# EAGLE design SV3 (EAGLE 9.6.2)
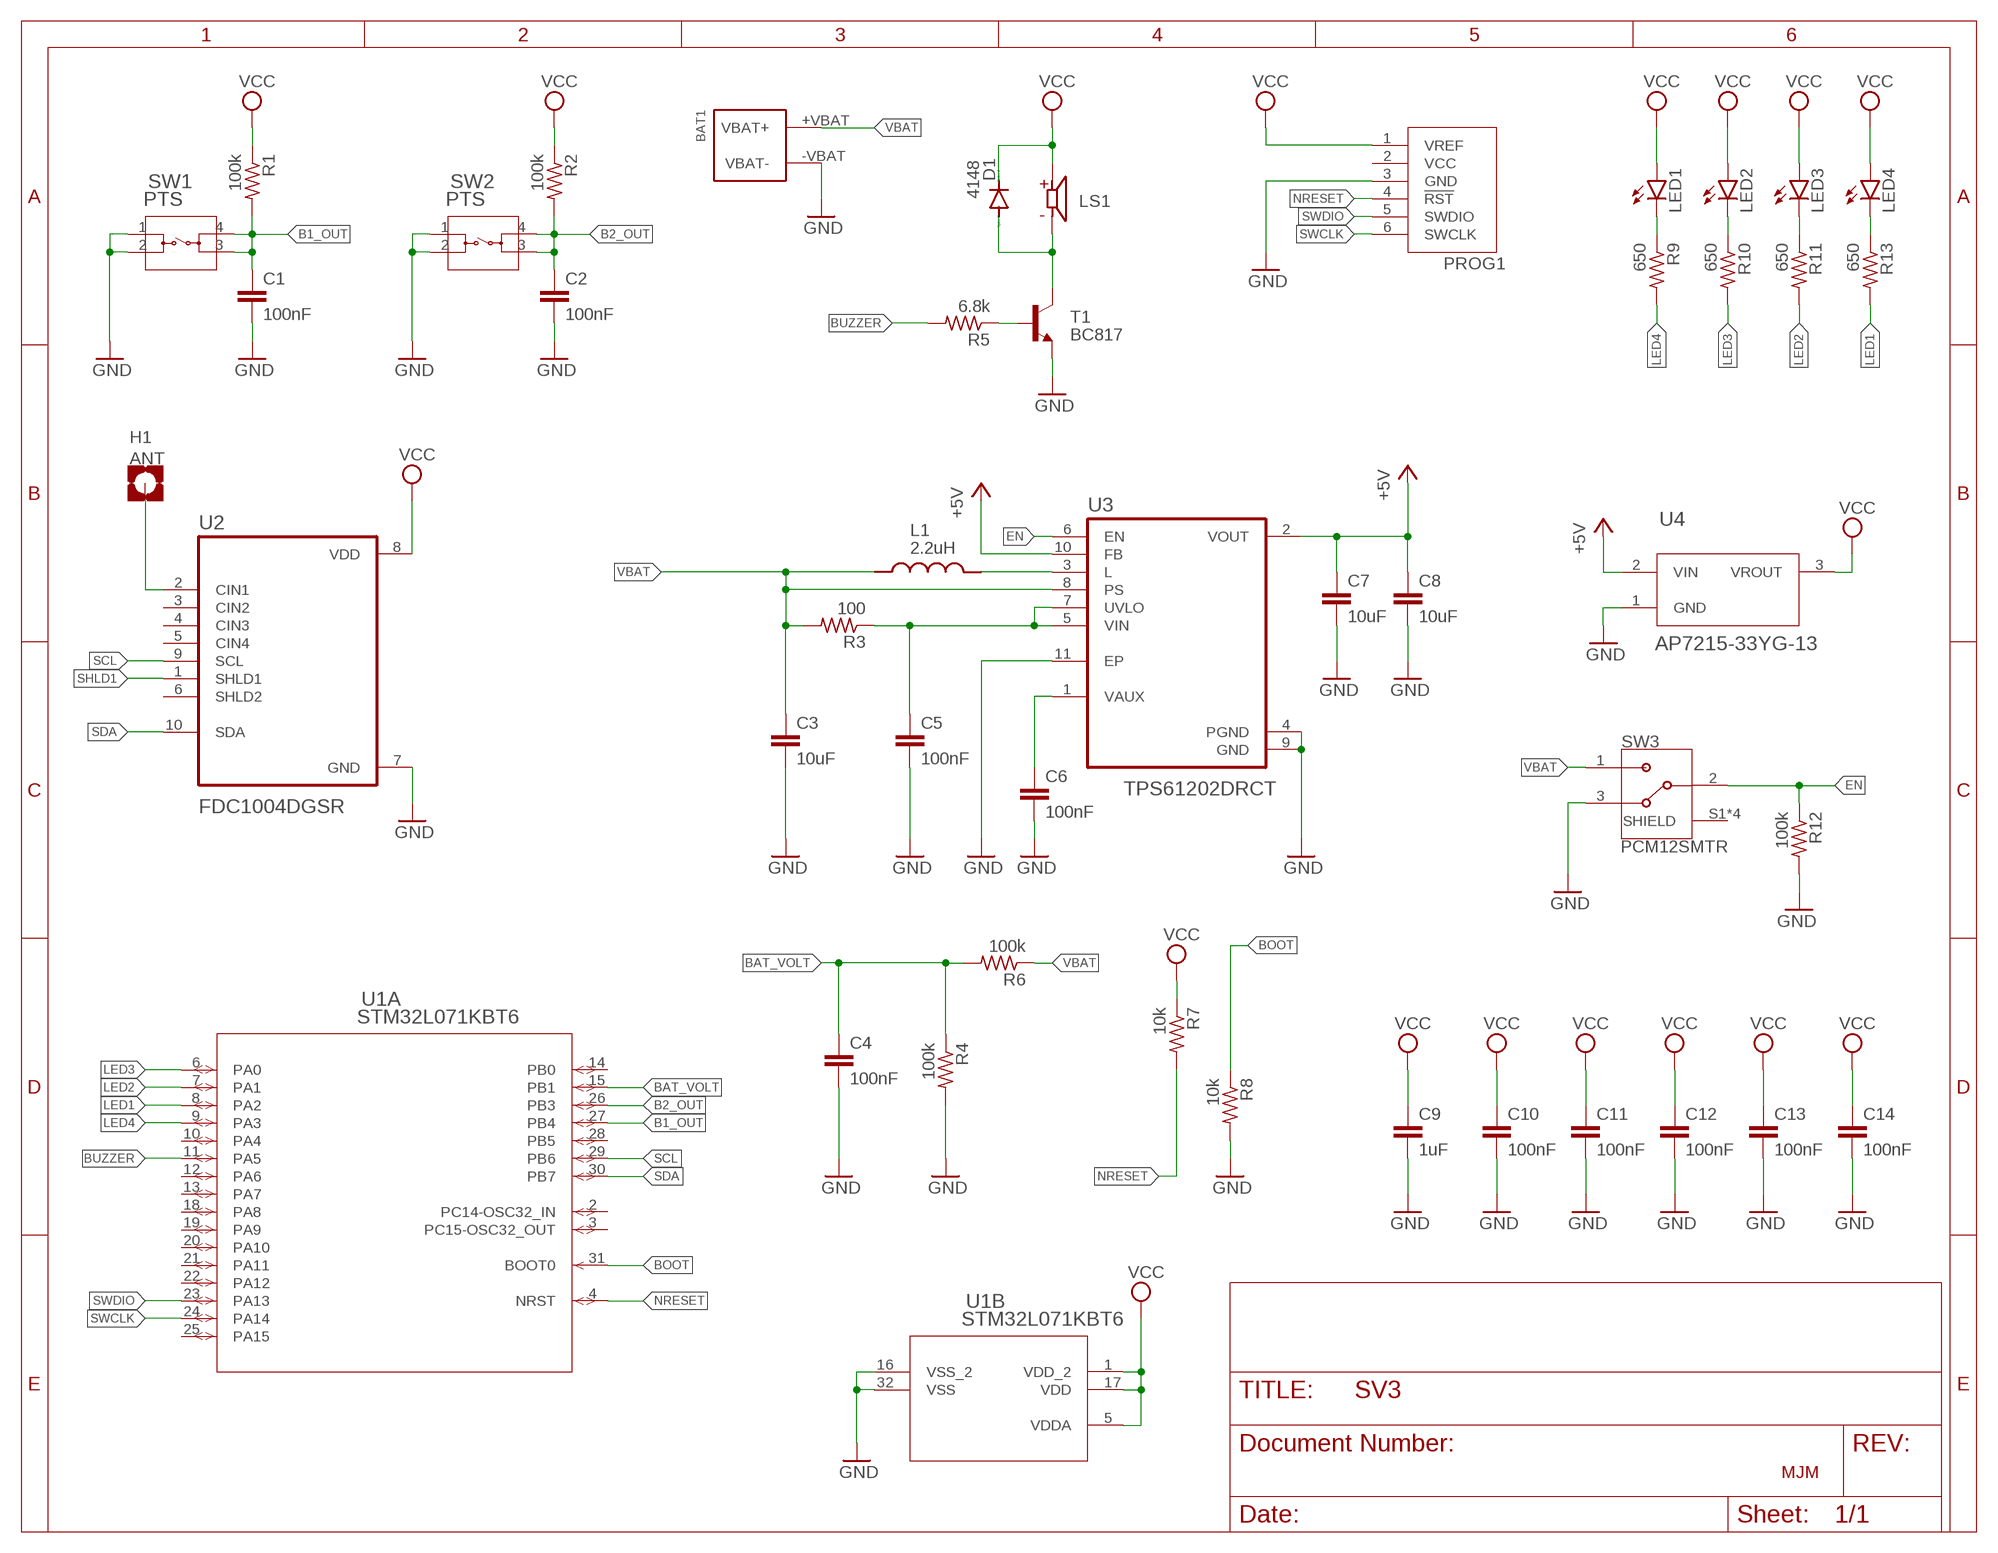
[diagram p0: schematic, sheet 1]

## Parts
BAT1  2462_NO_HOLES  [2462_NO-MOUNTING-HOLES]
C1  100nF  C-EUC0603  [C0603]
C2  100nF  C-EUC0603  [C0603]
C3  10uF  C-EUC0805  [C0805]
C4  100nF  C-EUC0603  [C0603]
C5  100nF  C-EUC0603  [C0603]
C6  100nF  C-EUC0603  [C0603]
C7  10uF  C-EUC0805  [C0805]
C8  10uF  C-EUC0805  [C0805]
C9  1uF  C-EUC0603  [C0603]
C10  100nF  C-EUC0603  [C0603]
C11  100nF  C-EUC0603  [C0603]
C12  100nF  C-EUC0603  [C0603]
C13  100nF  C-EUC0603  [C0603]
C14  100nF  C-EUC0603  [C0603]
D1  4148  DIODE-SOD80C  [SOD80C]
H1  ANT  ANT_37CM  [3,3-PAD-SQUARE]
L1  2.2uH  LQH2HPZ2R2MJRL  [IND_LQH2HPZ2R2MJRL]
LED1  LEDCHIPLED_0805  [CHIPLED_0805]
LED2  LEDCHIPLED_0805  [CHIPLED_0805]
LED3  LEDCHIPLED_0805  [CHIPLED_0805]
LED4  LEDCHIPLED_0805  [CHIPLED_0805]
LS1  CSS-0575A-SMT  [CUI_CSS-0575A-SMT]
PROG1  0532610671  [0532610671]
R1  100k  R-US_R0603  [R0603]
R2  100k  R-US_R0603  [R0603]
R3  100  R-US_R0603  [R0603]
R4  100k  R-US_R0603  [R0603]
R5  6.8k  R-US_R0603  [R0603]
R6  100k  R-US_R0603  [R0603]
R7  10k  R-US_R0603  [R0603]
R8  10k  R-US_R0603  [R0603]
R9  650  R-US_R0603  [R0603]
R10  650  R-US_R0603  [R0603]
R11  650  R-US_R0603  [R0603]
R12  100k  R-US_R0603  [R0603]
R13  650  R-US_R0603  [R0603]
SW1  PTS  PTS_647_SN50_SMTR2_LFSPTS_647_SN50_SMTR2_LFS-M  [PTS_647_SN50_SMTR2_LFS-M]
SW2  PTS  PTS_647_SN50_SMTR2_LFSPTS_647_SN50_SMTR2_LFS-M  [PTS_647_SN50_SMTR2_LFS-M]
SW3  PCM12SMTR  [SW_PCM12SMTR]
T1  BC817  MMBT2222ALT1-NPN-SOT23-BEC  [SOT23-BEC]
U1  STM32L071KBT6  [LQFP32_7X7X1P4]
U2  FDC1004DGSR  [SOP50P490X110-10N]
U3  TPS61202DRCT  TPS61201DRCR  [VREG_V62/16624-01YE]
U4  AP7215-33YG-13  AP7215-33YG-13SOT89-3L_DIO-L  [SOT89-3L_DIO-L]

## Nets
+5V: C7.1 C8.1 U3.2(VOUT) U3.10(FB) U4.2(VIN)
B: R5.1 T1.B
B1_OUT: C1.1 R1.2 SW1.3 SW1.4 U1.27(A:PB4)
B2_OUT: C2.1 R2.2 SW2.3 SW2.4 U1.26(A:PB3)
BAT_VOLT: C4.1 R4.1 R6.2 U1.15(A:PB1)
BOOT: R8.1 U1.31(A:BOOT0)
BUZZER: R5.2 U1.11(A:PA5)
C: D1.A LS1.2(N) T1.C
EN: R12.1 SW3.2 U3.6(EN)
GND: BAT1.-VBAT(VBAT-) C1.2 C2.2 C3.2 C4.2 C5.2 C6.2 C7.2 C8.2 C9.2 C10.2 C11.2 C12.2 C13.2 C14.2 PROG1.3(GND) R4.2 R8.2 R12.2 SW1.1 SW1.2 SW2.1 SW2.2 SW3.3 T1.E U1.16(B:VSS_2) U1.32(B:VSS) U2.7(GND) U3.4(PGND) U3.9(GND) U3.11(EP) U4.1(GND)
LED1: R13.2 U1.8(A:PA2)
LED2: R11.2 U1.7(A:PA1)
LED3: R10.2 U1.6(A:PA0)
LED4: R9.2 U1.9(A:PA3)
N$2: H1.B3,3(MOUNT) U2.2(CIN1)
N$4: C5.1 R3.1 U3.5(VIN) U3.7(UVLO)
N$6: L1.2 U3.3(L)
N$7: C6.1 U3.1(VAUX)
N$11: LED1.C R9.1
N$12: LED2.C R10.1
N$14: LED3.C R11.1
N$15: LED4.C R13.1
NRESET: PROG1.4(!RST) R7.2 U1.4(A:NRST)
SCL: U1.29(A:PB6) U2.9(SCL)
SDA: U1.30(A:PB7) U2.10(SDA)
SHLD1: U2.1(SHLD1)
SWCLK: PROG1.6(SWCLK) U1.24(A:PA14)
SWDIO: PROG1.5(SWDIO) U1.23(A:PA13)
VBAT: BAT1.+VBAT(VBAT+) C3.1 L1.1 R3.2 R6.1 SW3.1 U3.8(PS)
VCC: C9.1 C10.1 C11.1 C12.1 C13.1 C14.1 D1.C LED1.A LED2.A LED3.A LED4.A LS1.1(P) PROG1.1(VREF) R1.1 R2.1 R7.1 U1.1(B:VDD_2) U1.5(B:VDDA) U1.17(B:VDD) U2.8(VDD) U4.3(VROUT)
Unconnected: PROG1.2(VCC) SW3.S1(SHIELD) SW3.S2(SHIELD) SW3.S3(SHIELD) SW3.S4(SHIELD) U1.2(A:PC14-OSC32_IN) U1.3(A:PC15-OSC32_OUT) U1.10(A:PA4) U1.12(A:PA6) U1.13(A:PA7) U1.14(A:PB0) U1.18(A:PA8) U1.19(A:PA9) U1.20(A:PA10) U1.21(A:PA11) U1.22(A:PA12) U1.25(A:PA15) U1.28(A:PB5) U2.3(CIN2) U2.4(CIN3) U2.5(CIN4) U2.6(SHLD2)

## Notes on the sheet
- MJM

## Library data of the parts
BAT1 = 2462_batt_holder:2462
C1-C14 = rcl:C-EU: CAPACITOR, European symbol; SPICEPREFIX: C
D1 = diode:DIODE-: DIODE
H1 = ANT_37CM:ANT_37CM
L1 = LQH2HPZ2R2MJRL:LQH2HPZ2R2MJRL: 10µH Shielded Wirewound Inductor 490mA 456mOhm Max 1008 (2520 Metric); DESCRIPTION: Inductor with Inductance: 2.2uH Tol. +/-20%, Package: 1008 (2520); DIGI-KEY_PART_NUMBER: 490-15899-1-ND; MF: Murata; MP: LQH2HPZ2R2MJRL; PACKAGE: NONSTANDARD
LED1-LED4 = led:LED: LED OSRAM: - CHIPLED LG R971, LG N971, LY N971, LG Q971, LY Q971, LO R971, LY R971 LH N974, LH R974 LS Q976, LO Q976, LY Q976 LO Q996 - Hyper CHIPLED LW Q18S LB Q993, LB Q99A, LB R99A - SideLED LS A670, LO A670, LY A670, LG A670, LP A670 LB A673, LV A673, LT A673, LW A673 LH A674 LY A675 LS A676, LA A676, LO A676, LY A676, LW A676 LS A679, LY A679, LG A679 - Hyper Micro SIDELED® LS Y876, LA Y876, LO Y876, LY Y876 LT Y87S - SmartLED LW L88C, LW L88S LB L89C, LB L89S, LG L890 LS L89K, LO L89K, LY L89K LS L896, LA L896, LO L896, LY L896 - TOPLED LS T670, LO T670, LY T670, LG T670, LP T670 LSG T670, LSP T670, LSY T670, LOP T670, LYG T670 LG T671, LOG T671, LSG T671 LB T673, LV T673, LT T673, LW T673 LH T674 LS T676, LA T676, LO T676, LY T676, LB T676, LH T676, LSB T676, LW T676 LB T67C, LV T67C, LT T67C, LS T67K, LO T67K, LY T67K, LW E67C LS E67B, LA E67B, LO E67B, LY E67B, LB E67C, LV E67C, LT E67C LW T67C LS T679, LY T679, LG T679 LS T770, LO T770, LY T770, LG T770, LP T770 LB T773, LV T773, LT T773, LW T773 LH T774 LS E675, LA E675, LY E675, LS T675 LS T776, LA T776, LO T776, LY T776, LB T776 LHGB T686 LT T68C, LB T68C - Hyper Mini TOPLED® LB M676 - Mini TOPLED Santana® LG M470 LS M47K, LO M47K, LY M47K Source: http://www.osram.convergy.de LUXEON: - LUMILED® LXK2-PW12-R00, LXK2-PW12-S00, LXK2-PW14-U00, LXK2-PW14-V00 LXK2-PM12-R00, LXK2-PM12-S00, LXK2-PM14-U00 LXK2-PE12-Q00, LXK2-PE12-R00, LXK2-PE12-S00, LXK2-PE14-T00, LXK2-PE14-U00 LXK2-PB12-K00, LXK2-PB12-L00, LXK2-PB12-M00, LXK2-PB14-N00, LXK2-PB14-P00, LXK2-PB14-Q00 LXK2-PR12-L00, LXK2-PR12-M00, LXK2-PR14-Q00, LXK2-PR14-R00 LXK2-PD12-Q00, LXK2-PD12-R00, LXK2-PD12-S00 LXK2-PH12-R00, LXK2-PH12-S00 LXK2-PL12-P00, LXK2-PL12-Q00, LXK2-PL12-R00 Source: www.luxeon.com KINGBRIGHT: KA-3528ASYC Source: www.kingbright.com
LS1 = CSS-0575A-SMT:CSS-0575A-SMT: 5 mm, 3 V, 75 dB, Surface Mount (SMT), Magnetic Audio Transducer Buzzer; CUI_PURCHASE_URL: https://www.cuidevices.com/product/audio/buzzers/audio-transducers/css-0575a-smt-tr?utm_source=snapeda.com&utm_medium=referral&utm_campaign=snapedaBOM; DESCRIPTION: 5 mm, 3 V, 76 dB, Surface Mount (SMT), Magnetic Audio Transducer Buzzer; DIGI-KEY_PART_NUMBER: 102-2201-1-ND; MF: CUI Devices; MP: CSS-0575A-SMT-TR; PACKAGE: 6-DIP-6 CUI
PROG1 = 0532610671:0532610671
R1-R13 = rcl:R-US_: RESISTOR, American symbol; SPICEPREFIX: R
SW1 SW2 = PTS-647-SN50-SMTR2-LFS:PTS_647_SN50_SMTR2_LFS; BUILT_BY: EMA_Cory; COPYRIGHT: Copyright (C) 2018 Accelerated Designs. All rights reserved; DATASHEET: https://dznh3ojzb2azq.cloudfront.net/products/Tactile/PTS647/documents/datasheet.pdf; MANUFACTURER_PART_NUMBER: PTS 647 SN50 SMTR2 LFS; SOURCELIBRARY: C&K_2020-03-06; VENDOR: C&K
SW3 = PCM12SMTR:PCM12SMTR: Switch Slide ON ON SPDT Side Slide 0.3A 6VDC 10000Cycles Gull Wing SMD T/R; DESCRIPTION: Slide Switch SPDT Surface Mount, Right Angle; DIGI-KEY_PART_NUMBER: 401-2016-1-ND; MF: C&K; MP: PCM12SMTR; PACKAGE: DO-201 C&amp;K Components
T1 = transistor:*-NPN-: NPN Transistror BF959 corrected 2008.03.06
U1 = STM32L071KBT6:STM32L071KBT6; BUILT_BY: EMA_UL_Team; COPYRIGHT: Copyright (C) 2018 Accelerated Designs. All rights reserved; MANUFACTURER_PART_NUMBER: STM32L071KBT6; SOURCELIBRARY: Updates_to_database_2020-10-19; VENDOR: STMicroelectronics
U2 = FDC1004DGSR:FDC1004DGSR: Check prices <https://pricing.snapeda.com/parts/FDC1004DGSR/Texas%20Instruments/view-part?ref=eda>; AVAILABILITY: In Stock; DESCRIPTION: 4-Ch, 16-bit, capacitance to digital converter with active shield driver 10-VSSOP -40 to 125; MF: Texas Instruments; MP: FDC1004DGSR; PACKAGE: VSSOP-10 Texas Instruments; PRICE: None; PURCHASE-URL: https://pricing.snapeda.com/search/part/FDC1004DGSR/?ref=eda
U3 = TPS61201DRCR:TPS61201DRCR; DESCRIPTION: 0.3V Input, 3.3V Output Voltage Boost Converter with 1.3A Switches and 'Down Mode' in a 3x3 QFN 10-VSON -40 to 85; DIGI-KEY_PART_NUMBER: 296-44338-1-ND; MF: Texas Instruments; MP: TPS61201DRCR; PACKAGE: VSON-10 Texas Instruments; PURCHASE-URL: https://pricing.snapeda.com/search/part/TPS61201DRCR/?ref=eda
U4 = AP7215-33YG-13:AP7215-33YG-13; BUILT_BY: EMA_UL_Team; MANUFACTURER_PART_NUMBER: AP7215-33YG-13; SOURCELIBRARY: DIODESINC_2_2015-08-18; VENDOR: Diodes Inc

## Board
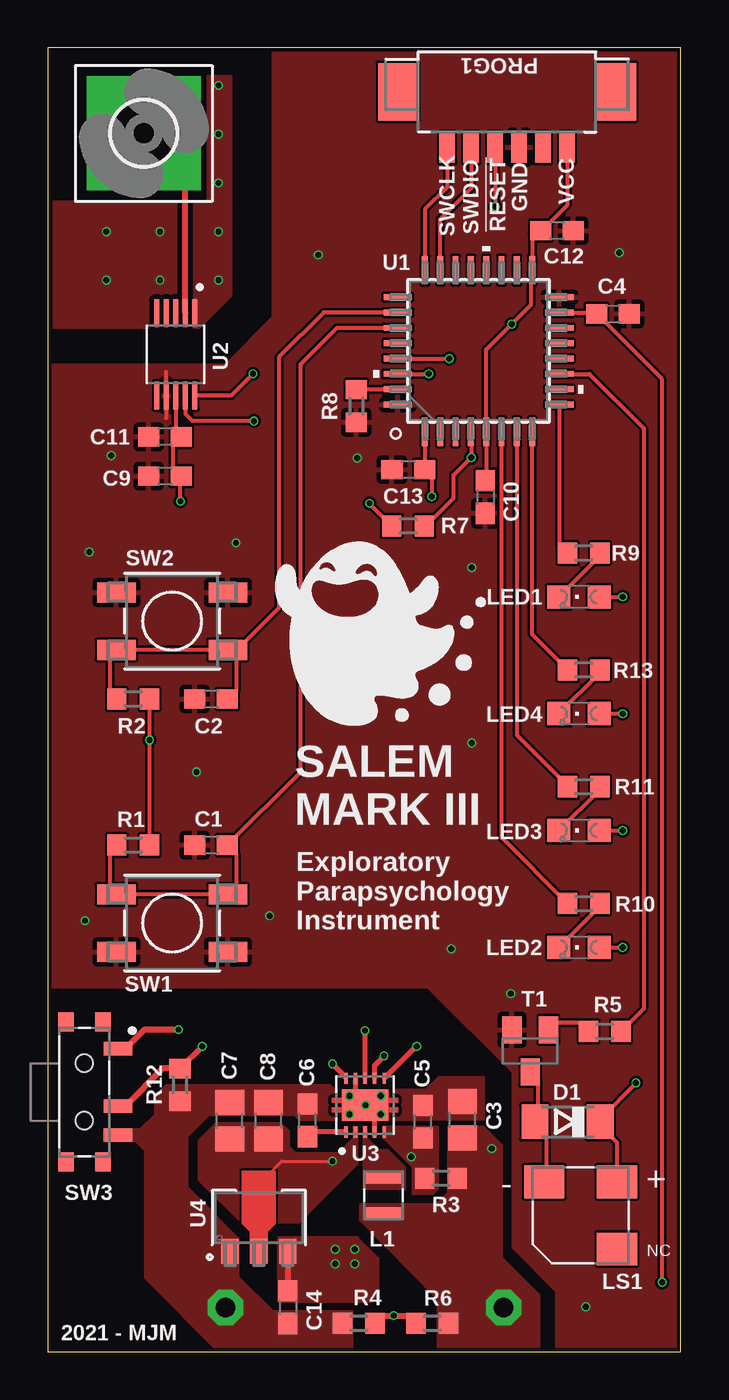
[diagram p1: board, top side]
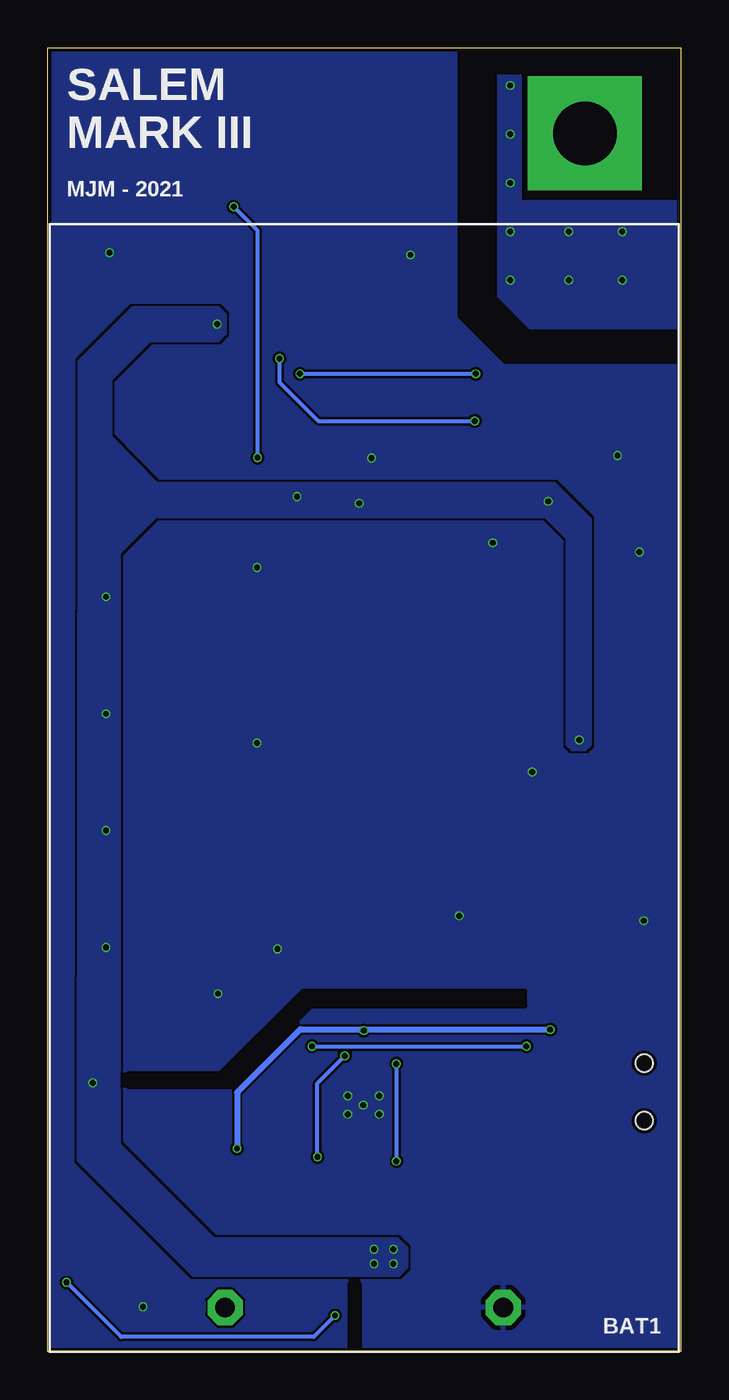
[diagram p2: board, bottom side, seen from below]

Size 33 x 68 mm. Coordinates in mm from the lower left corner, seen from the top.
Outline: 0,0 33,0 33,68 0,68 0,0
Copper layers (1*16): Top 0.035mm / dielectric 1.6mm / Bottom 0.035mm
Design rules "jlcpcb-2layers_tinted_vias": minimum track width 5mil, minimum drill 0.3mm, track to track 5mil, track to pad 5mil, pad to pad 5mil, via to via 5mil, smd to smd 5mil, copper to edge 0.2mm, drill to drill 6mil, minimum pad ring 10mil, minimum via ring 3mil, stop-mask expansion 4mil, vias tented up to drill 20mil, thermal gap 10mil
bRestrict: 12 lines

### Footprints (pad centres in the part's own frame; a part is rotated, then mirrored left to right if it is on the bottom)
2462_NO-MOUNTING-HOLES = drill 1.02 octagon: +VBAT 7.25,-2.3; -VBAT -7.25,-2.3
C0603 = smd 1.1 x 1: 1 -0.85,0; 2 0.85,0
C0805 = smd 1.3 x 1.5: 1 -0.95,0; 2 0.95,0
SOD80C = smd 1.4 x 1.8: A 1.7,0; C -1.7,0
3,3-PAD-SQUARE = drill 3.3 pad 5.842 square: B3,3 0,0
IND_LQH2HPZ2R2MJRL = smd 0.625 x 2: 1 -0.938,0; 2 0.938,0
CHIPLED_0805 = smd 1.2 x 1.2: A 0,-1.05; C 0,1.05
CUI_CSS-0575A-SMT = smd 2.1 x 1.7: 1 -1.9,-1.75; 2 1.9,-1.75; 3 -1.9,1.75
0532610671 = smd 0.8 x 1.6: 1 -3.125,0.8; 2 -1.875,0.8; 3 -0.625,0.8; 4 0.625,0.8; 5 1.875,0.8; 6 3.125,0.8 | smd 2.1 x 3: 7 -5.675,-2.1; 8 5.67,-2.1
R0603 = smd 1 x 1.1: 1 -0.85,0; 2 0.85,0
PTS_647_SN50_SMTR2_LFS-M = smd 2.007 x 1.041: 1 -2.908,1.5; 2 2.908,1.5; 3 -2.908,-1.5; 4 2.908,-1.5
SW_PCM12SMTR = smd 0.7 x 1.5: 1 -2.25,1.75; 2 0.75,1.75; 3 2.25,1.75 | smd 1 x 0.8: S1 -3.65,0.965; S2 -3.65,-0.965; S3 3.65,-0.965; S4 3.65,0.965 | hole 0.9: -1.5,0; 1.5,0
SOT23-BEC = smd 1 x 1.4: B -0.95,-1.1; C 0,1.1; E 0.95,-1.1
LQFP32_7X7X1P4 = smd 1.473 x 0.305: 1 -4.216,2.8; 2 -4.216,2; 3 -4.216,1.2; 4 -4.216,0.4; 5 -4.216,-0.4; 6 -4.216,-1.2; 7 -4.216,-2; 8 -4.216,-2.8; 17 4.216,-2.8; 18 4.216,-2; 19 4.216,-1.2; 20 4.216,-0.4; 21 4.216,0.4; 22 4.216,1.2; 23 4.216,2; 24 4.216,2.8 | smd 0.305 x 1.473: 9 -2.8,-4.216; 10 -2,-4.216; 11 -1.2,-4.216; 12 -0.4,-4.216; 13 0.4,-4.216; 14 1.2,-4.216; 15 2,-4.216; 16 2.8,-4.216; 25 2.8,4.216; 26 2,4.216; 27 1.2,4.216; 28 0.4,4.216; 29 -0.4,4.216; 30 -1.2,4.216; 31 -2,4.216; 32 -2.8,4.216
SOP50P490X110-10N = smd 1.47 x 0.28: 1 -2.15,1; 2 -2.15,0.5; 3 -2.15,0; 4 -2.15,-0.5; 5 -2.15,-1; 6 2.15,-1; 7 2.15,-0.5; 8 2.15,0; 9 2.15,0.5; 10 2.15,1
VREG_V62/16624-01YE = smd 0.6 x 0.24: 1 -1.4,1; 2 -1.4,0.5; 3 -1.4,0; 4 -1.4,-0.5; 5 -1.4,-1; 6 1.4,-1; 7 1.4,-0.5; 8 1.4,0; 9 1.4,0.5; 10 1.4,1 | smd 1.65 x 2.4: 11 0,0
SOT89-3L_DIO-L = smd 0.9 x 1.3: 1 -1.5,-1.751; 2 0,-1.751; 3 1.5,-1.751

### Placement (x,y rotation side)
BAT1  16.51,0 180 bottom
C1  8.51,26.42 180 top
C2  8.51,34.04 180 top
C3  21.62,12.09 90 top
C4  29.46,54.13 0 top
C5  19.56,11.99 90 top
C6  13.54,12.06 90 top
C7  9.47,12.04 90 top
C8  11.51,12.04 90 top
C9  6.1,45.66 180 top
C10  22.81,44.58 270 top
C11  6.1,47.71 180 top
C12  26.55,58.47 0 top
C13  18.79,46 180 top
C14  12.5,2.31 270 top
D1  27.1,11.99 180 top
H1  5,63.54 0 top
L1  17.5,8.15 90 top
LED1  27.69,39.37 90 top
LED2  27.69,21.08 90 top
LED3  27.69,27.18 90 top
LED4  27.69,33.27 90 top
LS1  27.77,7.11 180 top
PROG1  23.94,63.61 180 top
R1  4.45,26.42 180 top
R2  4.45,34.04 180 top
R3  20.5,9.04 0 top
R4  16.21,1.47 180 top
R5  29.03,16.7 0 top
R6  20.04,1.47 180 top
R7  18.78,43.07 0 top
R8  16.08,49.32 270 top
R9  27.94,41.66 180 top
R10  27.94,23.37 180 top
R11  27.94,29.46 180 top
R12  6.88,13.91 270 top
R13  27.94,35.56 180 top
SW1  6.48,22.35 180 top
SW2  6.48,38.1 0 top
SW3  1.9,13.54 270 top
T1  25.15,15.68 180 top
U1  22.45,52.2 90 top
U2  6.66,52.02 270 top
U3  16.54,12.85 90 top
U4  11,6.99 0 top
U$1  [GHOST]  11.68,32.56 0 top

### Tracks (layer width: path | path; a pad name or v marks a point on that pad's centre or on a via)
+5V  (via drill 0.3)
  Top 0.152: U3.10 15.54,14.31 | U4.2 11,8.74 12.19,9.93 v14.83,9.93
  Top 0.254: 15.54,14.31 v14.83,15.01
  Bottom 0.203: v14.83,15.01 v14.83,9.93
  pour Top (no thermals): 15.95,11.73 16.13,11.73 16.13,9.75 13.08,6.71 10.11,6.71 7.87,8.94 7.87,11.02 8.79,11.94 12.12,11.94 12.55,11.51 12.55,10.72 12.9,10.36 15.16,10.36 15.95,11.15
B
  Top 0.203: R5.1 27.74,17.14 26.45,17.14 T1.B
B1_OUT
  Top 0.203: R1.2 3.21,26.03 3.21,24.21 SW1.4 SW1.3 9.82,24.28 9.82,25.96 C1.1 13.16,30.21 13.16,51.49 15.07,53.4 U1.27
B2_OUT
  Top 0.152: SW2.4 9.85,36.6
  Top 0.203: R2.2 3.21,34.42 3.21,36.24 SW2.3 SW2.4 9.82,36.17 9.82,34.49 C2.1 | 9.85,36.6 12.04,38.79 12.04,51.87 14.37,54.2 U1.26
BAT_VOLT  (via drill 0.3)
  Top 0.203: U1.15 28.54,54.2 C4.1 32.03,50.71 v32.03,3.61 | R4.1 17.46,1.88
  Top 0.305: 17.46,1.88 v18.03,1.88 18.78,1.88 R6.2
  Bottom 0.203: v18.03,1.88 19.15,0.76 29.18,0.76 v32.03,3.61
BOOT
  Top 0.152: R8.1 16.11,50.2
  Top 0.203: 16.11,50.2 U1.31
BUZZER
  Top 0.152: R5.2
  Top 0.203: U1.11 28.23,51 31.06,48.16 31.06,17.88 R5.2
C
  Top 0.203: T1.C 25.55,14.18 25.55,12.14 D1.A 25.98,11.4 25.98,8.96 LS1.2
EN  (via drill 0.3)
  Top 0.152: 17.55,14.27 U3.6
  Top 0.203: v8.05,15.93 | v19.23,15.93 19.21,15.93 | SW3.2 4.03,12.79
  Top 0.254: 19.21,15.93 17.55,14.27
  Top 0.305: v8.05,15.93 R12.1 6,14.76 4.03,12.79
  Bottom 0.203: v19.23,15.93 v8.05,15.93
GND  (via drill 0.3)
  Top 0.203: 6.16,48.71 U2.7 6.16,51.09
  Top 0.254: U3.9 16.04,13.24 | U3.4 17.04,12.38
  other vias: 16.56,12.85 15.72,13.34 15.72,12.38 17.36,13.34 17.36,12.38 24.13,18.67 1.93,22.48 2.16,41.71 3.3,46.74 29.79,57.33 16.13,46.61 22.1,40.89 7.75,30.23 11.56,22.73 22.1,31.75 14.1,57.2 9.8,42.19 28.04,2.34 21.03,21.01
  pour Top (isolate 0.203, no thermals): 2.95,11.61 4.8,11.61 5.59,12.37 5.59,13.35 6.17,13.92 14.71,13.92 14.96,13.67 19.71,13.67 20.37,14.33 22.73,14.33 22.73,12.09 20.02,12.09 19.99,12.06 13.13,12.06 12.88,12.32 8.38,12.32 7.26,11.2 7.26,8.59 9.93,5.92 9.93,3.91 11.71,2.13 15.88,2.13 15.88,0 8.89,0 5.08,3.81 5.08,10.46 4.57,10.97 2.95,10.97
  pour Top: 33.02,67.94 11.76,67.94 11.76,53.92 9.27,51.44 0,51.44 0,19.05 19.81,19.05 24.26,14.61 24.26,5.46 26.54,3.17 26.54,0 33.02,0
  pour Bottom (rank 5): 0,51.44 0,0 33.02,0 33.02,67.94 11.76,67.94 11.76,53.92 9.27,51.44
LED1
  Top 0.152: R13.2 27.09,35.57
  Top 0.203: 27.09,35.57 25.25,37.41 U1.8
LED2
  Top 0.152: 27.09,29.53 R11.2
  Top 0.203: U1.7 24.45,32.16 27.09,29.53
LED3
  Top 0.152: R10.2
  Top 0.203: R10.2 23.65,26.82 U1.6
LED4
  Top 0.203: U1.9 26.67,42.08 R9.2
N$2
  Top 0.305: U2.2 7.16,60.87 5,63.03 H1.B3,3
N$4  (via drill 0.3)
  Top 0.254: U3.7 17.04,14.93 v17.53,15.42
  Bottom 0.203: v18.95,10.16 18.95,13.99 v17.53,15.42
  pour Top (no thermals): 17.45,11.71 17.45,11.18 19,9.63 19,8.23 20.09,8.23 20.35,8.48 20.35,11.71
N$6
  pour Top (no thermals): 16.43,11.73 16.43,8.48 18.64,8.48 18.64,9.6 17.75,10.49 17.27,10.49 16.64,11.13 16.64,11.73
N$7
  Top 0.152: 13.57,11.25 C6.1
  Top 0.203: 13.78,11.45 13.57,11.25
  Top 0.254: U3.1 13.78,11.45
N$11
  Top 0.203: LED1.C 28.79,41.52 R9.1
N$12
  Top 0.203: LED2.C 28.79,23.24 R10.1
N$14
  Top 0.203: LED3.C 28.79,29.33 R11.1
N$15
  Top 0.203: LED4.C 28.79,35.43 R13.1
NRESET  (via drill 0.3)
  Top 0.203: PROG1.4 v23.32,59.72 | U1.4 22.07,47.96 v22.07,46.63 21.16,45.72 21.16,44.53 19.7,43.07 R7.2
  Bottom 0.203: v23.32,59.72 22.07,58.47 v22.07,46.63
SCL  (via drill 0.3)
  Top 0.203: U2.9 7.16,48.92 7.54,48.54 v10.74,48.54 | U1.29 v20.92,51.8 v20.93,51.79
  Bottom 0.203: v20.93,51.79 20.93,50.57 18.9,48.54 v10.74,48.54
SDA  (via drill 0.3)
  Top 0.203: U2.10 9.56,49.87 v10.69,51 | U1.30 v19.86,51
  Bottom 0.203: v19.86,51 v10.69,51
SHLD1  (via drill 0.3)
  other vias: 5.84,58.42 8.89,55.88 8.89,58.42 8.89,60.96 8.89,63.5 8.89,66.04 5.84,55.88 3.05,58.42 3.05,55.88
  pour Bottom (no thermals): 9.55,66.55 9.55,55.04 7.9,53.39 0.03,53.39 0.03,59.99 8.33,59.99 8.33,66.55
  pour Top (isolate 0.254, no thermals): 0.03,59.99 8.33,59.99 8.33,66.55 9.55,66.55 9.55,55.04 7.9,53.39 0.03,53.39
SWCLK
  Top 0.203: PROG1.6 20.81,60.74 19.65,59.58 U1.24
SWDIO
  Top 0.203: U1.23 20.45,59.06 22.06,60.67 PROG1.5
VBAT  (via drill 0.3)
  Top 0.203: 4.03,15.79 SW3.1
  Top 0.254: U3.8 v16.54,16.74
  Top 0.305: v6.81,16.79 5.03,16.79 4.03,15.79
  Bottom 0.305: v23.14,10.59 23.14,13.51 19.84,16.82 16.61,16.82 v16.54,16.74 16.46,16.82 6.83,16.82 v6.81,16.79
  pour Top (no thermals): 25.63,0.03 20.32,0.03 20.32,2.74 16.28,6.84 16.28,7.7 20.27,7.7 20.88,8.31 20.88,11.76 22.71,11.76 23.67,10.79 23.67,4.93 25.63,2.97
VCC  (via drill 0.3)
  Top 0.152: D1.C 28.8,12.12 | v30.66,14.02 30.66,13.98
  Top 0.203: R2.1 v5.29,31.9 R1.1 | LS1.1 29.68,10.89 28.8,11.77 D1.C | 30.66,13.98 28.8,12.12 | LED2.A v29.97,21.08 | LED3.A v29.97,27.18 | LED4.A 28.75,33.29 29.34,33.27 v29.97,33.27 | LED1.A v29.97,39.37 | U2.8 6.66,48 C11.1 6.51,47.28 6.51,46.1 C9.1 6.91,45.63 v6.91,44.35 | v20.02,44.6 20.02,45.62 C13.1 19.65,46.01 U1.1 | PROG1.1 27.07,62.81 27.07,59.79 25.75,58.47 C12.1 25.35,58.47 25.25,58.37 U1.17 25.18,56.34 25.18,54.59 v24.18,53.59 22.85,52.27 U1.5 22.85,45.47 C10.1 | R7.1 16.76,44.23 v16.76,44.25
  Top 0.305: U4.3 C14.1
  other vias: 14.99,5.33 14.99,4.57 16,4.57 16,5.33
  pour Bottom (isolate 0.254, rank 4): 14.3,4.37 14.71,3.96 25.43,3.96 31.42,9.96 31.37,48.13 31.37,51.69 28.57,54.48 24.13,54.48 23.75,54.1 23.75,53.09 24.13,52.7 27.69,52.7 29.72,50.67 29.72,47.76 27.33,45.31 6.58,45.31 4.72,43.46 4.72,31.62 4.98,31.37 5.66,31.37 5.92,31.62 5.92,42.42 7.04,43.54 27.38,43.54 29.29,41.63 29.29,10.85 24.36,5.92 14.78,5.92 14.3,5.44
  pour Top (no thermals): 12.04,5.92 12.04,2.64 16.81,2.64 17.21,3.03 17.21,4.82 16.1,5.92

### Text on the board
tPlace: VCC | GND | SWCLK | SWDIO | !RESET | SALEM / MARK III | Exploratory / Parapsychology / Instrument | 2021 - MJM
bPlace: SALEM / MARK III | MJM - 2021